# EAGLE design tinyg_g2_breakout_v1 (EAGLE 7.5.0)
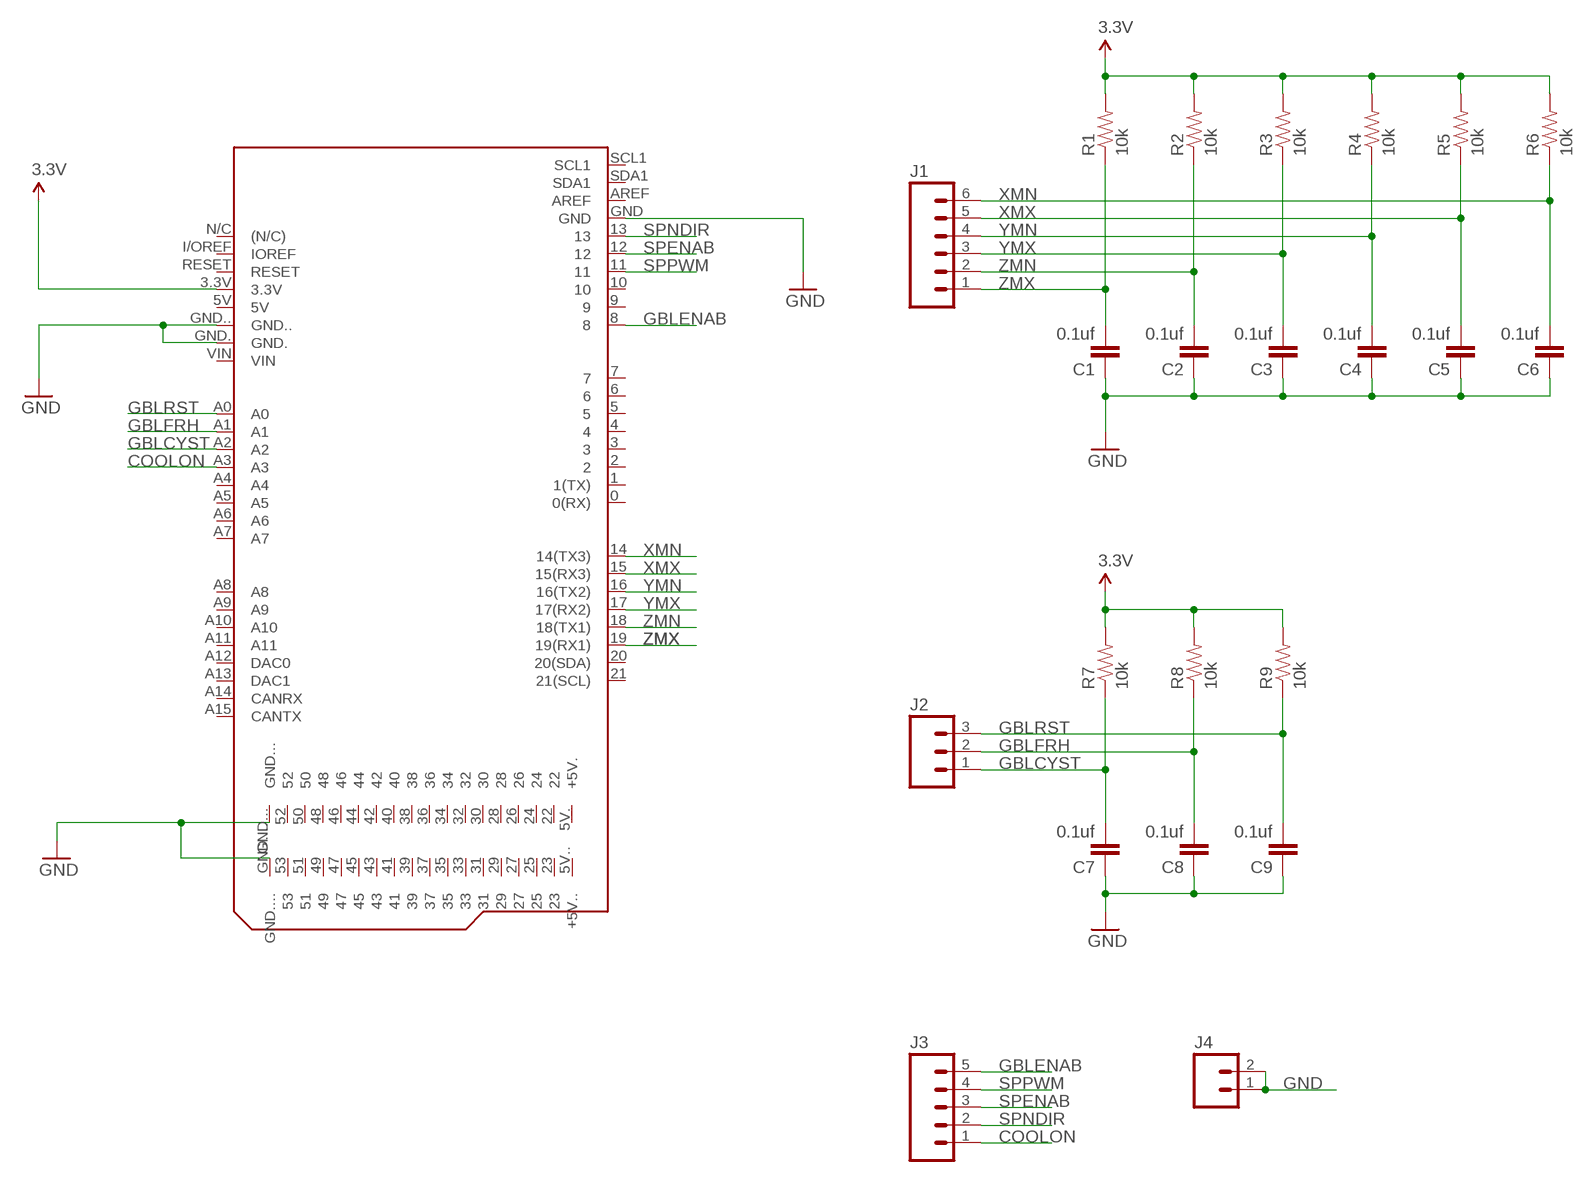
[diagram p0: schematic, sheet 1]

## Parts
C1  0.1uf  CAPPTH  [CAP-PTH-SMALL]
C2  0.1uf  CAPPTH  [CAP-PTH-SMALL]
C3  0.1uf  CAPPTH  [CAP-PTH-SMALL]
C4  0.1uf  CAPPTH  [CAP-PTH-SMALL]
C5  0.1uf  CAPPTH  [CAP-PTH-SMALL]
C6  0.1uf  CAPPTH  [CAP-PTH-SMALL]
C7  0.1uf  CAPPTH  [CAP-PTH-SMALL]
C8  0.1uf  CAPPTH  [CAP-PTH-SMALL]
C9  0.1uf  CAPPTH  [CAP-PTH-SMALL]
J1  M06SILK_FEMALE_PTH  [1X06]
J2  M03PTH  [1X03]
J3  M05PTH  [1X05]
J4  M02PTH  [1X02]
PCB1  ARDUINO_DUE_SHIELD  [ARDUINO_DUE_SHIELD]
R1  10k  RESISTORAXIAL-0.3  [AXIAL-0.3]
R2  10k  RESISTORAXIAL-0.3  [AXIAL-0.3]
R3  10k  RESISTORAXIAL-0.3  [AXIAL-0.3]
R4  10k  RESISTORAXIAL-0.3  [AXIAL-0.3]
R5  10k  RESISTORAXIAL-0.3  [AXIAL-0.3]
R6  10k  RESISTORAXIAL-0.3  [AXIAL-0.3]
R7  10k  RESISTORAXIAL-0.3  [AXIAL-0.3]
R8  10k  RESISTORAXIAL-0.3  [AXIAL-0.3]
R9  10k  RESISTORAXIAL-0.3  [AXIAL-0.3]

## Nets
3.3V: PCB1.3.3V R1.P$2 R2.P$2 R3.P$2 R4.P$2 R5.P$2 R6.P$2 R7.P$2 R8.P$2 R9.P$2
COOLON: J3.1 PCB1.A3
GBLCYST: C7.2 J2.1 PCB1.A2 R7.P$1
GBLENAB: J3.5 PCB1.8
GBLFRH: C8.2 J2.2 PCB1.A1 R8.P$1
GBLRST: C9.2 J2.3 PCB1.A0 R9.P$1
GND: C1.1 C2.1 C3.1 C4.1 C5.1 C6.1 C7.1 C8.1 C9.1 J4.1 J4.2 PCB1.GND PCB1.GND. PCB1.GND.. PCB1.GND... PCB1.GND....
SPENAB: J3.3 PCB1.12
SPNDIR: J3.2 PCB1.13
SPPWM: J3.4 PCB1.11
XMN: C6.2 J1.6 PCB1.14(14(TX3)) R6.P$1
XMX: C5.2 J1.5 PCB1.15(15(RX3)) R5.P$1
YMN: C4.2 J1.4 PCB1.16(16(TX2)) R4.P$1
YMX: C3.2 J1.3 PCB1.17(17(RX2)) R3.P$1
ZMN: C2.2 J1.2 PCB1.18(18(TX1)) R2.P$1
ZMX: C1.2 J1.1 PCB1.19(19(RX1)) R1.P$1
Unconnected: PCB1.0(0(RX)) PCB1.1(1(TX)) PCB1.2 PCB1.3 PCB1.4 PCB1.5 PCB1.5V PCB1.5V.(+5V.) PCB1.5V..(+5V..) PCB1.6 PCB1.7 PCB1.9 PCB1.10 PCB1.20(20(SDA)) PCB1.21(21(SCL)) PCB1.22 PCB1.23 PCB1.24 PCB1.25 PCB1.26 PCB1.27 PCB1.28 PCB1.29 PCB1.30 PCB1.31 PCB1.32 PCB1.33 PCB1.34 PCB1.35 PCB1.36 PCB1.37 PCB1.38 PCB1.39 PCB1.40 PCB1.41 PCB1.42 PCB1.43 PCB1.44 PCB1.45 PCB1.46 PCB1.47 PCB1.48 PCB1.49 PCB1.50 PCB1.51 PCB1.52 PCB1.53 PCB1.A4 PCB1.A5 PCB1.A6 PCB1.A7 PCB1.A8 PCB1.A9 PCB1.A10 PCB1.A11 PCB1.A12(DAC0) PCB1.A13(DAC1) PCB1.A14(CANRX) PCB1.A15(CANTX) PCB1.AREF PCB1.I/OREF(IOREF) PCB1.N/C((N/C)) PCB1.RESET PCB1.SCL1 PCB1.SDA1 PCB1.VIN

## Library data of the parts
C1-C9 = SparkFun-Passives:CAP: Capacitor Standard 0603 ceramic capacitor, and 0.1" leaded capacitor.
J1 = SparkFun-Connectors:M06: Header 6 Standard 6-pin 0.1" header. Use with straight break away headers (SKU : PRT-00116), right angle break away headers (PRT-00553), swiss pins (PRT-00743), machine pins (PRT-00117), and female headers (PRT-00115). Molex polarized connector foot print use with SKU : PRT-08094 with associated crimp pins and housings. NOTES ON THE VARIANTS LOCK and LOCK_LONGPADS... This footprint was designed to help hold the alignment of a through-hole component (i.e. 6-pin header) while soldering it into place. You may notice that each hole has been shifted either up or down by 0.005 of an inch from it's more standard position (which is a perfectly straight line). This slight alteration caused the pins (the squares in the middle) to touch the edges of the holes. Because they are alternating, it causes a "brace" to hold the component in place. 0.005 has proven to be the perfect amount of "off-center" position when using our standard breakaway headers. Although looks a little odd when you look at the bare footprint, once you have a header in there, the alteration is very hard to notice. Also,if you push a header all the way into place, it is covered up entirely on the bottom side. This idea of altering the position of holes to aid alignment will be further integrated into the Sparkfun Library for other footprints. It can help hold any component with 3 or more connection pins.; PROD_ID: CONN-08437
J2 = SparkFun-Connectors:M03: Header 3 Standard 3-pin 0.1" header. Use with straight break away headers (SKU : PRT-00116), right angle break away headers (PRT-00553), swiss pins (PRT-00743), machine pins (PRT-00117), and female headers (PRT-00115). Molex polarized connector foot print use with SKU : PRT-08232 with associated crimp pins and housings.
J3 = SparkFun-Connectors:M05: Header 5 Standard 5-pin 0.1" header. Use with straight break away headers (SKU : PRT-00116), right angle break away headers (PRT-00553), swiss pins (PRT-00743), machine pins (PRT-00117), and female headers (PRT-00115). Molex polarized connector foot print use with SKU : PRT-08230 with associated crimp pins and housings.
J4 = SparkFun-Connectors:M02: Standard 2-pin 0.1" header. Use with - straight break away headers ( PRT-00116) - right angle break away headers (PRT-00553) - swiss pins (PRT-00743) - machine pins (PRT-00117) - female headers (PRT-00115) Molex polarized connector foot print use with: PRT-08233 with associated crimp pins and housings. 2.54_SCREWTERM for use with PRT-10571. 3.5mm Screw Terminal footprints for PRT-08084 5mm Screw Terminal footprints for use with PRT-08432
PCB1 = machadolab:ARDUINO_DUE_SHIELD: Device for representing an Arduino Due board with a footprint in an EAGLE design. Created by Dave Young for Element14. More EAGLE documentation at: http://www.element14.com/community/community/knode/cadsoft_eagle
R1-R9 = SparkFun-Passives:RESISTOR: Resistor Basic schematic elements and footprints for 0603, 1206, and PTH resistors.

## Board
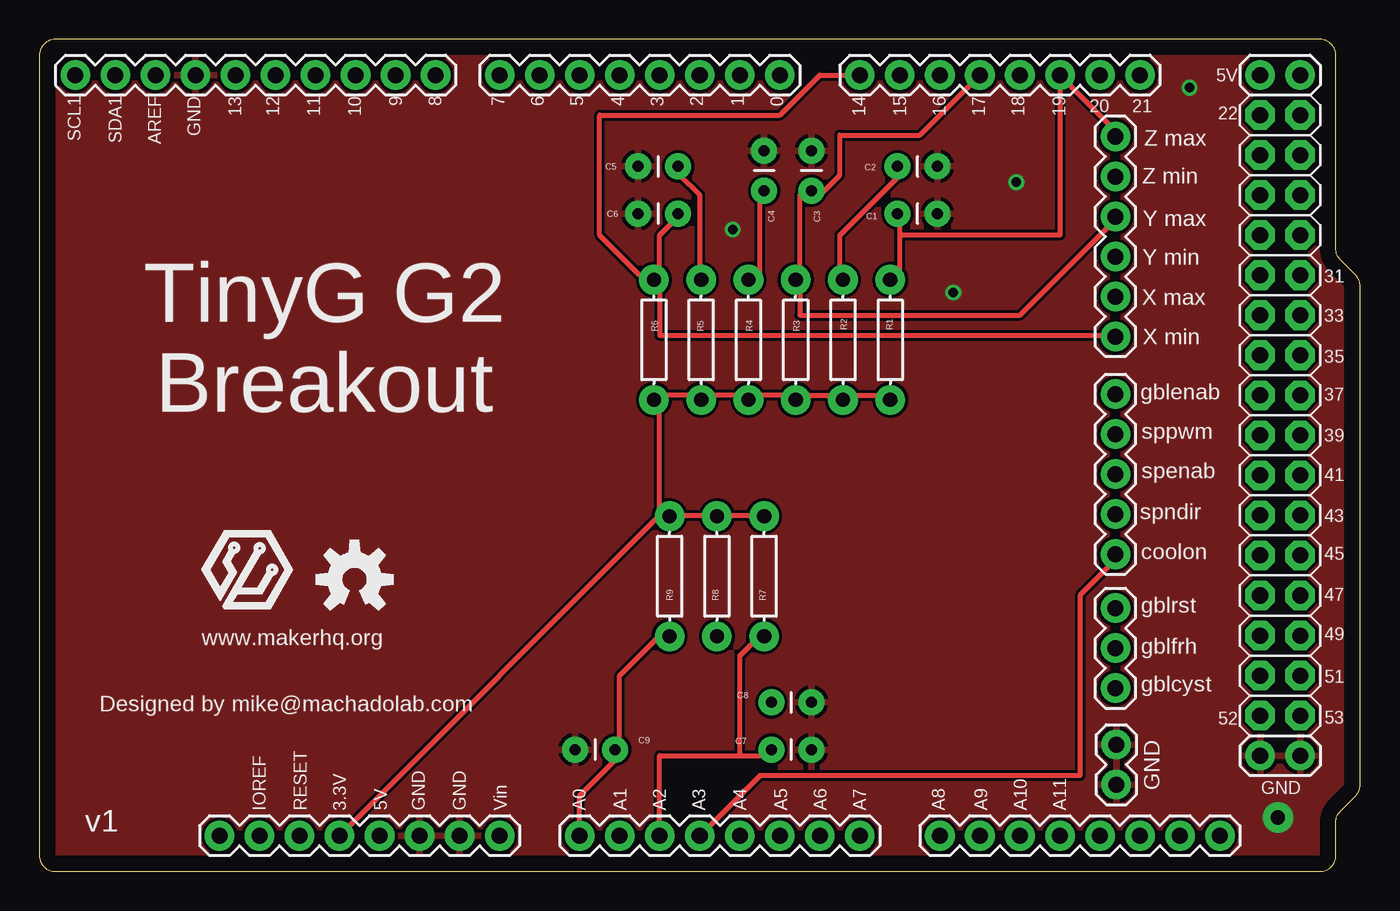
[diagram p1: board, top side]
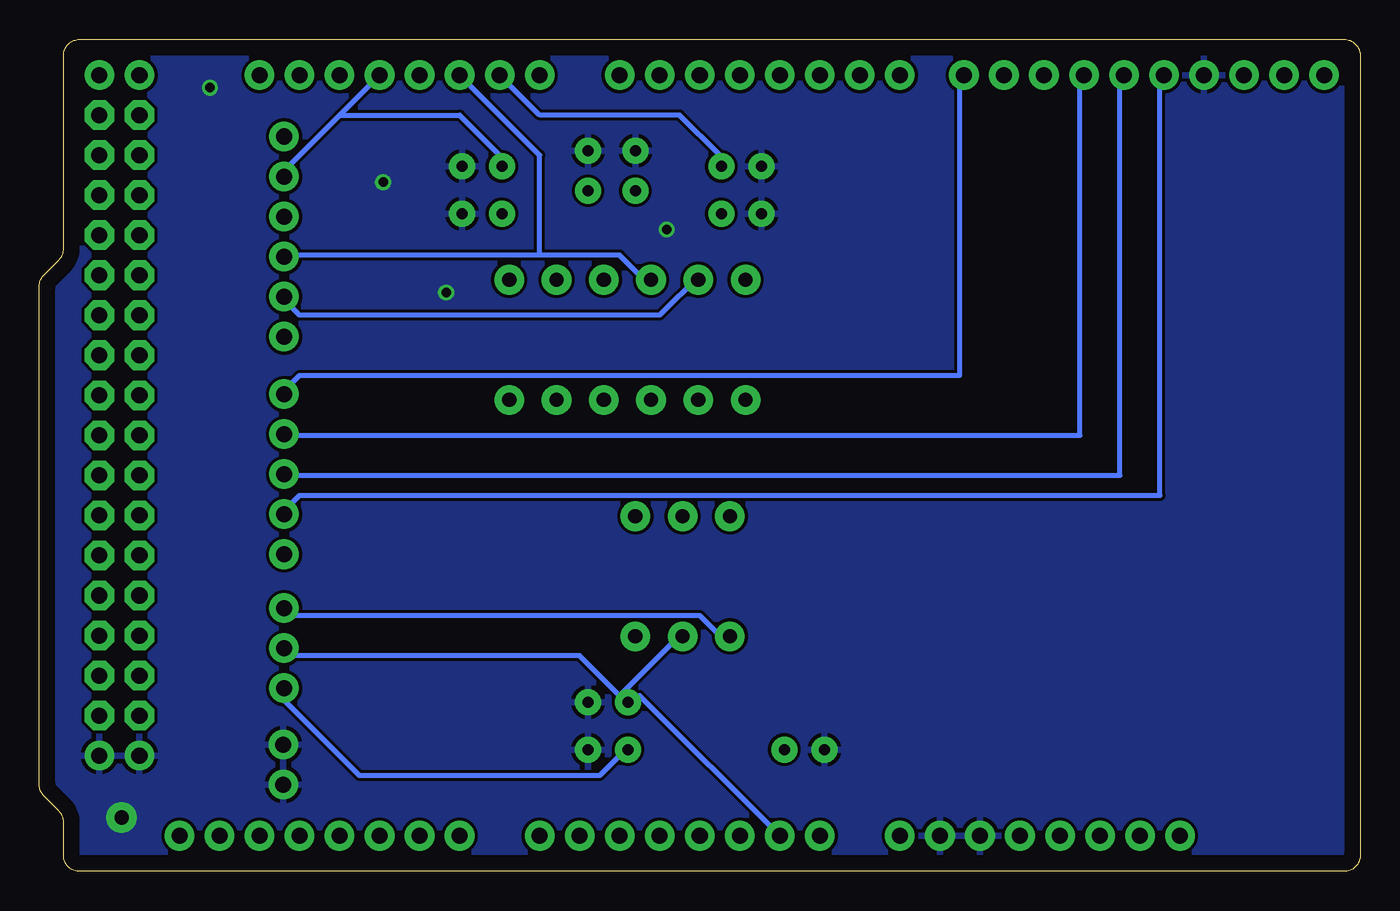
[diagram p2: board, bottom side, seen from below]

Size 83.82 x 52.79 mm. Coordinates in mm from the lower left corner, seen from the top.
Outline: 0,51.79 0,1 arc90 1,0 81.28,0 arc90 82.28,1 82.28,3.13 arc-45 82.57,3.83 83.53,4.79 arc45 83.82,5.49 83.82,37.15 arc45 83.53,37.85 82.57,38.81 arc-45 82.28,39.51 82.28,51.79 arc90 81.28,52.79 1,52.79 arc90 0,51.79
Copper layers (1*16): Top 0.035mm / dielectric 1.5mm / Bottom 0.035mm
Design rules "default *": minimum track width 12mil, minimum drill 24mil, track to track 8mil, track to pad 8mil, pad to pad 8mil, via to via 8mil, smd to smd 8mil, copper to edge 40mil, drill to drill 8mil, minimum pad ring 10mil, minimum via ring 8mil, stop-mask expansion 4mil, vias tented up to drill 0mil, thermal gap 10mil

### Footprints (pad centres in the part's own frame; a part is rotated, then mirrored left to right if it is on the bottom)
CAP-PTH-SMALL = drill 0.7 pad 1.651: 1 0,0; 2 2.54,0
1X06 = drill 1.016 pad 1.88: 1 0,0; 2 2.54,0; 3 5.08,0; 4 7.62,0; 5 10.16,0; 6 12.7,0
1X03 = drill 1.016 pad 1.88: 1 0,0; 2 2.54,0; 3 5.08,0
1X05 = drill 1.016 pad 1.88: 1 0,0; 2 2.54,0; 3 5.08,0; 4 7.62,0; 5 10.16,0
1X02 = drill 1.016 pad 1.88: 1 0,0; 2 2.54,0
ARDUINO_DUE_SHIELD = drill 1.016 pad 1.88: 0 45.72,49.53; 1 43.18,49.53; 2 40.64,49.53; 3 38.1,49.53; 3.3V 17.78,1.27; 4 35.56,49.53; 5 33.02,49.53; 5V 20.32,1.27; 5V. 76.2,49.53; 5V.. 78.74,49.53; 6 30.48,49.53; 7 27.94,49.53; 8 23.876,49.53; 9 21.336,49.53; 10 18.796,49.53; 11 16.256,49.53; 12 13.716,49.53; 13 11.176,49.53; 14 50.8,49.53; 15 53.34,49.53; 16 55.88,49.53; 17 58.42,49.53; 18 60.96,49.53; 19 63.5,49.53; 20 66.04,49.53; 21 68.58,49.53; A0 33.02,1.27; A1 35.56,1.27; A2 38.1,1.27; A3 40.64,1.27; A4 43.18,1.27; A5 45.72,1.27; A6 48.26,1.27; A7 50.8,1.27; A8 55.88,1.27; A9 58.42,1.27; A10 60.96,1.27; A11 63.5,1.27; A12 66.04,1.27; A13 68.58,1.27; A14 71.12,1.27; A15 73.66,1.27; AREF 6.096,49.53; GND 8.636,49.53; GND. 25.4,1.27; GND.. 22.86,1.27; GND... 76.2,6.35; GND.... 78.74,6.35; I/OREF 12.7,1.27; N/C 10.16,1.27; RESET 15.24,1.27; SCL1 1.016,49.53; SDA1 3.556,49.53; VIN 27.94,1.27 | drill 1.016 pad 1.88 octagon: 22 76.2,46.99; 23 78.74,46.99; 24 76.2,44.45; 25 78.74,44.45; 26 76.2,41.91; 27 78.74,41.91; 28 76.2,39.37; 29 78.74,39.37; 30 76.2,36.83; 31 78.74,36.83; 32 76.2,34.29; 33 78.74,34.29; 34 76.2,31.75; 35 78.74,31.75; 36 76.2,29.21; 37 78.74,29.21; 38 76.2,26.67; 39 78.74,26.67; 40 76.2,24.13; 41 78.74,24.13; 42 76.2,21.59; 43 78.74,21.59; 44 76.2,19.05; 45 78.74,19.05; 46 76.2,16.51; 47 78.74,16.51; 48 76.2,13.97; 49 78.74,13.97; 50 76.2,11.43; 51 78.74,11.43; 52 76.2,8.89; 53 78.74,8.89
AXIAL-0.3 = drill 0.9 pad 1.88: P$1 -3.81,0; P$2 3.81,0

### Placement (x,y rotation side)
C1  57,41.73 180 top
C2  57,44.73 180 top
C3  49,45.73 270 top
C4  46,45.73 270 top
C5  38,44.73 0 top
C6  38,41.73 0 top
C7  49,7.73 180 top
C8  49,10.73 180 top
C9  34,7.73 0 top
J1  68.3,46.63 270 top
J2  68.3,11.63 90 top
J3  68.3,20.13 90 top
J4  68.34,5.51 90 top
PCB1  1.27,1 0 top
R1  54,33.73 270 top
R2  51,33.73 270 top
R3  48,33.73 270 top
R4  45,33.73 270 top
R5  42,33.73 270 top
R6  39,33.73 270 top
R7  46,18.73 90 top
R8  43,18.73 90 top
R9  40,18.73 90 top
U$1  [OSHW-LOGO-M]  20,18.53 0 top
U$2  [MAKERHQ_LOGO_L]  10.3,16.63 0 top

### Tracks (layer width: path | path; a pad name or v marks a point on that pad's centre or on a via)
3.3V
  Top 0.305: 41.91,30.21 39.37,30.21 | 48.26,30.21 45.72,30.21 R4.P$2 44.45,30.21 41.91,30.21 | 48.26,30.21 50.8,30.21 | 48.26,30.21 R3.P$2 | 50.8,30.21 53.34,30.21 R1.P$2 | 50.8,30.21 R2.P$2 | 41.91,30.21 R5.P$2 | 39.37,22.59 PCB1.3.3V | 43.18,22.59 40.64,22.59 R9.P$2 39.37,22.59 | 43.18,22.59 45.72,22.59 R7.P$2 | 43.18,22.59 R8.P$2 | 39.37,22.59 39.37,30.21 | 39.37,30.21 R6.P$2
COOLON
  Top 0.305: PCB1.A3 45.72,6.08 66.04,6.08 66.04,17.51 68.58,20.05 J3.1
GBLCYST
  Top 0.305: 44.45,7.35 39.37,7.35 PCB1.A2 | 44.45,7.35 45.72,7.35 C7.2 | 44.45,7.35 44.45,13.7 45.72,14.97 R7.P$1
  Bottom 0.305: J2.1 68.58,11.16 63.5,6.08 48.26,6.08 46.99,7.35 C7.2
GBLENAB
  Bottom 0.305: PCB1.8 25.4,50.53 25.4,31.48 67.31,31.48 68.58,30.21 J3.5
GBLFRH
  Bottom 0.305: 46.99,11.16 43.18,14.97 R8.P$1 | PCB1.A1 45.72,11.16 46.99,11.16 | 46.99,11.16 49.53,13.7 68.58,13.7 J2.2 | 46.99,11.16 C8.2
GBLRST
  Top 0.305: 36.83,7.35 34.29,4.81 PCB1.A0 | 36.83,7.35 36.83,12.43 39.37,14.97 R9.P$1 | 36.83,7.35 C9.2
  Bottom 0.305: J2.3 68.58,16.24 41.91,16.24 40.64,14.97 R9.P$1
GND  (via drill 0.6, 0.9 pad 1.93)
  other vias: 44,40.73 62,43.73 58,36.73 73,49.73 78.6,3.43
  pour Top: 0,52.73 82,52.73 82,38.73 84,36.73 84,4.73 82,2.73 82,-0.27 0,-0.27
  pour Bottom: 0,52.73 82,52.73 82,38.73 84,36.73 84,4.73 82,2.73 82,-0.27 0,-0.27
SPENAB
  Bottom 0.305: PCB1.12 15.24,50.53 15.24,25.13 68.58,25.13 J3.3
SPNDIR
  Bottom 0.305: PCB1.13 12.7,50.53 12.7,23.86 67.31,23.86 68.58,22.59 J3.2
SPPWM
  Bottom 0.305: PCB1.11 17.78,50.53 17.78,27.67 68.58,27.67 J3.4
XMN
  Top 0.305: 39.37,37.83 39.37,40.37 40.64,41.64 C6.2 | 39.37,37.83 39.37,34.02 68.58,34.02 J1.6 | 39.37,37.83 R6.P$1 38.1,37.83 35.56,40.37 35.56,47.99 46.99,47.99 49.53,50.53 PCB1.14
XMX
  Top 0.305: C5.2 40.64,44.18 41.91,42.91 41.91,37.83 R5.P$1
  Bottom 0.305: J1.5 68.58,36.56 67.31,35.29 44.45,35.29 41.91,37.83 R5.P$1 | PCB1.15 52.07,47.99 43.18,47.99 40.64,45.45 C5.2
YMN
  Top 0.305: C4.2 45.72,42.91 45.72,37.83 R4.P$1
  Bottom 0.305: 52.07,39.1 46.99,39.1 45.72,37.83 R4.P$1 | 52.07,39.1 68.58,39.1 J1.4 | PCB1.16 52.07,45.45 52.07,39.1
YMX
  Top 0.305: 48.26,37.83 48.26,42.91 C3.2 49.53,42.91 50.8,44.18 50.8,46.72 55.88,46.72 PCB1.17 | 48.26,37.83 48.26,35.29 62.23,35.29 68.58,41.64 J1.3 | 48.26,37.83 R3.P$1
ZMN
  Top 0.305: C2.2 54.61,44.18 50.8,40.37 50.8,37.83 R2.P$1
  Bottom 0.305: 64.77,47.99 68.58,44.18 J1.2 | 64.77,47.99 PCB1.18 | 64.77,47.99 57.15,47.99 54.61,45.45 C2.2
ZMX
  Top 0.305: 54.61,40.37 54.61,37.83 R1.P$1 | 54.61,40.37 54.61,41.64 C1.2 | J1.1 68.58,46.72 PCB1.19 64.77,40.37 54.61,40.37

### Text on the board
tPlace: 5V | SCL1 | SDA1 | AREF | GND | 13 | 12 | 11 | 10 | 9 | 8 | 7 | 6 | 5 | 4 | 3 | 2 | 1 | 0 | 14 | 15 | 16 | 17 | 18 | 19 | 20 | 21 | 22 | Z max | Z min | Y max | Y min | 31 | X max | 33 | X min | TinyG G2 / Breakout | 35 | gblenab | 37 | sppwm | 39 | spenab | 41 | spndir | 43 | coolon | 45 | gblrst | 47 | 49 | www.makerhq.org | gblfrh | gblcyst | 51 | Designed by mike@machadolab.com | 52 | 53 | GND | GND | IOREF | RESET | 3.3V | 5V | GND | GND | Vin | A0 | A1 | A2 | A3 | A4 | A5 | A6 | A7 | A8 | A9 | A10 | A11 | v1